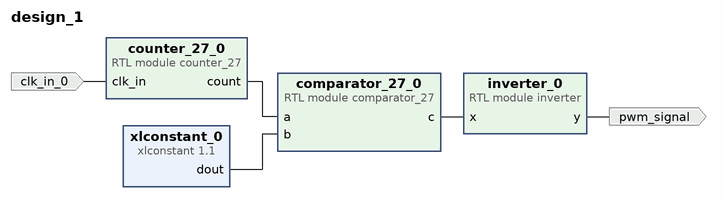
[diagram p0: block diagram of the top level]
# Vivado block design design_1, xc7z020clg400-1, Vivado 2019.1
create_bd_design design_1

create_bd_port -dir I clk_in_0
create_bd_port -dir O pwm_signal

create_bd_cell -type ip -vlnv xilinx.com:ip:xlconstant:1.1 xlconstant_0
set_property -dict {CONFIG.CONST_VAL 2866 CONFIG.CONST_WIDTH 12} [get_bd_cells xlconstant_0]
create_bd_cell -type module -reference counter_27 counter_27_0
create_bd_cell -type module -reference comparator_27 comparator_27_0
create_bd_cell -type module -reference inverter inverter_0

# ---- connections ----

connect_bd_net [get_bd_pins counter_27_0/count] [get_bd_pins comparator_27_0/a]
connect_bd_net [get_bd_pins xlconstant_0/dout] [get_bd_pins comparator_27_0/b]
connect_bd_net -net clk_in_0_1 [get_bd_ports clk_in_0] [get_bd_pins counter_27_0/clk_in]
connect_bd_net [get_bd_pins comparator_27_0/c] [get_bd_pins inverter_0/x]
connect_bd_net [get_bd_pins inverter_0/y] [get_bd_ports pwm_signal]

validate_bd_design
save_bd_design
